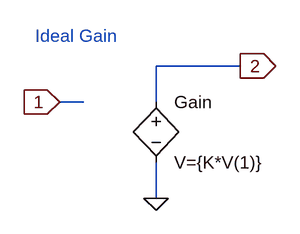
[diagram p0: schematic gain.asc]
gain.asc, the LTspice schematic file:
Version 4
SHEET 1 880 680
WIRE 224 64 112 64
WIRE 16 112 -16 112
WIRE 112 112 112 64
WIRE 112 240 112 192
FLAG -16 112 1
IOPIN -16 112 In
FLAG 224 64 2
IOPIN 224 64 Out
FLAG 112 240 0
SYMBOL bv 112 96 R0
SYMATTR InstName Gain
SYMATTR Value V={K*V(1)}
TEXT -48 24 Left 2 ;Ideal Gain

The netlist it stands for:
* gain.asc
B§Gain 2 0 V={K*V(1)}
* Ideal Gain
.backanno
.end